# EAGLE design snowflake-hw-simple-v0.0.1 (EAGLE 9.6.2)
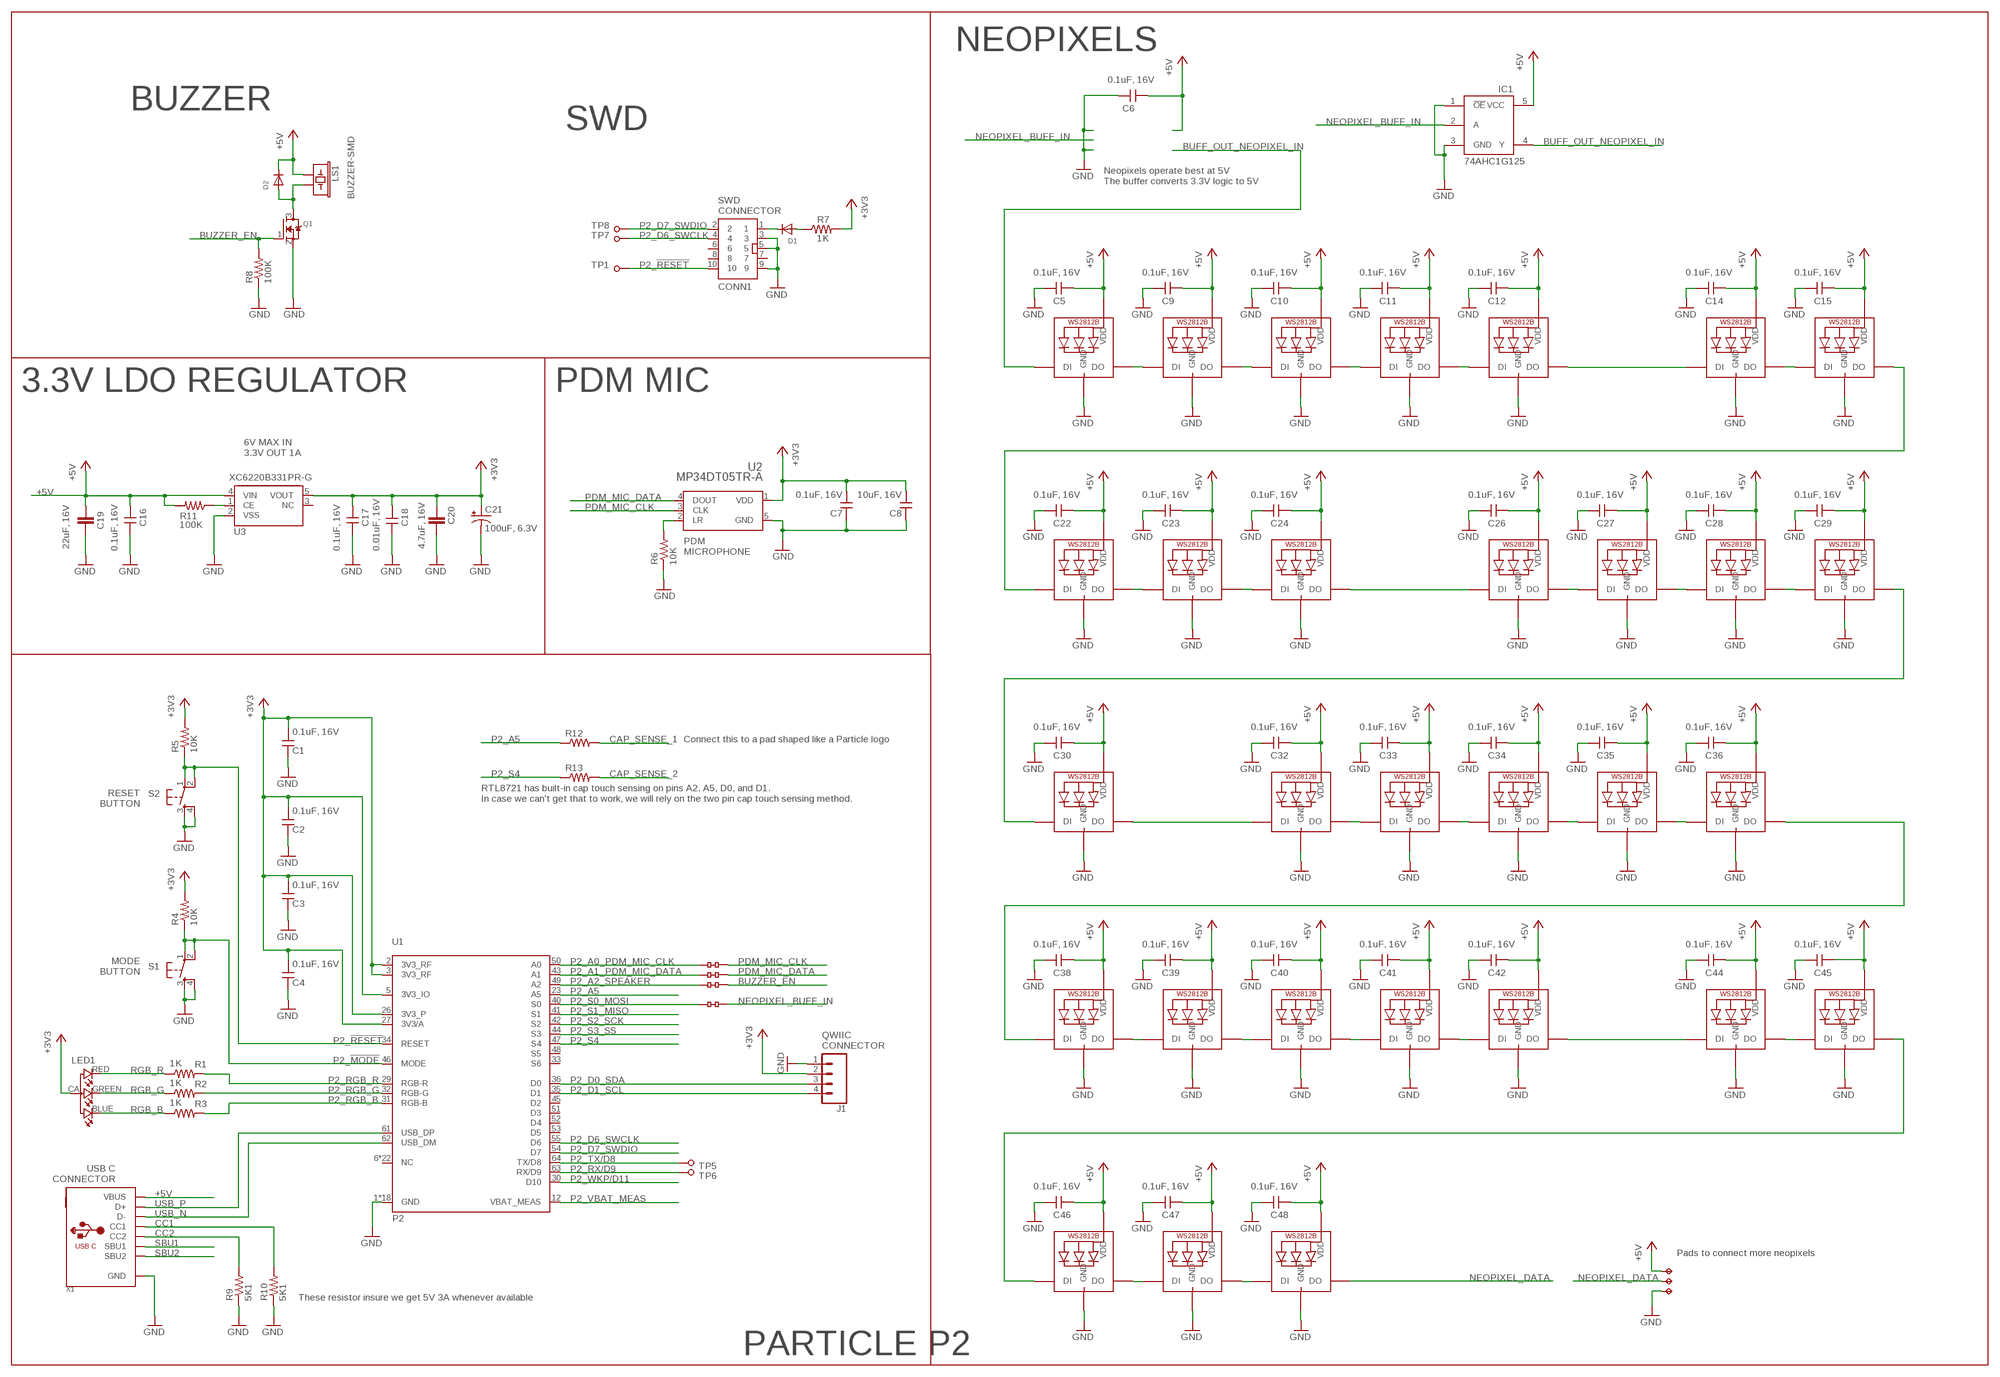
[diagram p0: schematic, sheet 1]

## Parts
C1  0.1uF, 16V  CAP_0.1UF_16V_0603  [C0603_P]
C2  0.1uF, 16V  CAP_0.1UF_16V_0603  [C0603_P]
C3  0.1uF, 16V  CAP_0.1UF_16V_0603  [C0603_P]
C4  0.1uF, 16V  CAP_0.1UF_16V_0603  [C0603_P]
C5  0.1uF, 16V  CAP_0.1UF_16V_0603  [C0603_P]
C6  0.1uF, 16V  CAP_0.1UF_16V_0603  [C0603_P]
C7  0.1uF, 16V  CAP_0.1UF_16V_0603  [C0603_P]
C8  10uF, 16V  CAP_10UF_16V_0603  [C0603_P]
C9  0.1uF, 16V  CAP_0.1UF_16V_0603  [C0603_P]
C10  0.1uF, 16V  CAP_0.1UF_16V_0603  [C0603_P]
C11  0.1uF, 16V  CAP_0.1UF_16V_0603  [C0603_P]
C12  0.1uF, 16V  CAP_0.1UF_16V_0603  [C0603_P]
C14  0.1uF, 16V  CAP_0.1UF_16V_0603  [C0603_P]
C15  0.1uF, 16V  CAP_0.1UF_16V_0603  [C0603_P]
C16  0.1uF, 16V  CAP_0.1UF_16V_0603  [C0603_P]
C17  0.1uF, 16V  CAP_0.1UF_16V_0603  [C0603_P]
C18  0.01uF, 16V  CAP_0.01UF_25V_0603  [C0603_P]
C19  22uF, 16V  C-EUC0805  [C0805]
C20  4.7uF, 16V  C-EUC0805  [C0805]
C21  100uF, 6.3V  CPOL-USC  [PANASONIC_C]
C22  0.1uF, 16V  CAP_0.1UF_16V_0603  [C0603_P]
C23  0.1uF, 16V  CAP_0.1UF_16V_0603  [C0603_P]
C24  0.1uF, 16V  CAP_0.1UF_16V_0603  [C0603_P]
C26  0.1uF, 16V  CAP_0.1UF_16V_0603  [C0603_P]
C27  0.1uF, 16V  CAP_0.1UF_16V_0603  [C0603_P]
C28  0.1uF, 16V  CAP_0.1UF_16V_0603  [C0603_P]
C29  0.1uF, 16V  CAP_0.1UF_16V_0603  [C0603_P]
C30  0.1uF, 16V  CAP_0.1UF_16V_0603  [C0603_P]
C32  0.1uF, 16V  CAP_0.1UF_16V_0603  [C0603_P]
C33  0.1uF, 16V  CAP_0.1UF_16V_0603  [C0603_P]
C34  0.1uF, 16V  CAP_0.1UF_16V_0603  [C0603_P]
C35  0.1uF, 16V  CAP_0.1UF_16V_0603  [C0603_P]
C36  0.1uF, 16V  CAP_0.1UF_16V_0603  [C0603_P]
C38  0.1uF, 16V  CAP_0.1UF_16V_0603  [C0603_P]
C39  0.1uF, 16V  CAP_0.1UF_16V_0603  [C0603_P]
C40  0.1uF, 16V  CAP_0.1UF_16V_0603  [C0603_P]
C41  0.1uF, 16V  CAP_0.1UF_16V_0603  [C0603_P]
C42  0.1uF, 16V  CAP_0.1UF_16V_0603  [C0603_P]
C44  0.1uF, 16V  CAP_0.1UF_16V_0603  [C0603_P]
C45  0.1uF, 16V  CAP_0.1UF_16V_0603  [C0603_P]
C46  0.1uF, 16V  CAP_0.1UF_16V_0603  [C0603_P]
C47  0.1uF, 16V  CAP_0.1UF_16V_0603  [C0603_P]
C48  0.1uF, 16V  CAP_0.1UF_16V_0603  [C0603_P]
CONN1  CONN5X2  [CONN5X2_1.27]
D1  DIODESOD-123  [SOD-123]
D2  DIODESOD-123  [SOD-123]
IC1  74AHC1G125  [SOT23-5L]
J1  CONN_04SMD4  [JST04_1MM_VERT]
LED1  RGB-LED-CLMVB-FKARGB  [PLCC4-2MM-RGB]
LED2  WS2812B_SK6812E  [NEO3535_REVERSE]
LED3  WS2812B_SK6812E  [NEO3535_REVERSE]
LED4  WS2812B_SK6812E  [NEO3535_REVERSE]
LED5  WS2812B_SK6812E  [NEO3535_REVERSE]
LED6  WS2812B_SK6812E  [NEO3535_REVERSE]
LED8  WS2812B_SK6812E  [NEO3535_REVERSE]
LED9  WS2812B_SK6812E  [NEO3535_REVERSE]
LED10  WS2812B_SK6812E  [NEO3535_REVERSE]
LED11  WS2812B_SK6812E  [NEO3535_REVERSE]
LED12  WS2812B_SK6812E  [NEO3535_REVERSE]
LED14  WS2812B_SK6812E  [NEO3535_REVERSE]
LED15  WS2812B_SK6812E  [NEO3535_REVERSE]
LED16  WS2812B_SK6812E  [NEO3535_REVERSE]
LED17  WS2812B_SK6812E  [NEO3535_REVERSE]
LED18  WS2812B_SK6812E  [NEO3535_REVERSE]
LED20  WS2812B_SK6812E  [NEO3535_REVERSE]
LED21  WS2812B_SK6812E  [NEO3535_REVERSE]
LED22  WS2812B_SK6812E  [NEO3535_REVERSE]
LED23  WS2812B_SK6812E  [NEO3535_REVERSE]
LED24  WS2812B_SK6812E  [NEO3535_REVERSE]
LED26  WS2812B_SK6812E  [NEO3535_REVERSE]
LED27  WS2812B_SK6812E  [NEO3535_REVERSE]
LED28  WS2812B_SK6812E  [NEO3535_REVERSE]
LED29  WS2812B_SK6812E  [NEO3535_REVERSE]
LED30  WS2812B_SK6812E  [NEO3535_REVERSE]
LED32  WS2812B_SK6812E  [NEO3535_REVERSE]
LED33  WS2812B_SK6812E  [NEO3535_REVERSE]
LED34  WS2812B_SK6812E  [NEO3535_REVERSE]
LED35  WS2812B_SK6812E  [NEO3535_REVERSE]
LED36  WS2812B_SK6812E  [NEO3535_REVERSE]
LS1  BUZZER-SMD  [BUZZER-CCV]
Q1  MOSFET-NREFLOW  [SOT23]
R1  1K  RES_1K_0603  [R0603_P]
R2  1K  RES_1K_0603  [R0603_P]
R3  1K  RES_1K_0603  [R0603_P]
R4  10K  RES_10K_0603  [R0603_P]
R5  10K  RES_10K_0603  [R0603_P]
R6  10K  RES_10K_0603  [R0603_P]
R7  1K  RES_1K_0603  [R0603_P]
R8  100K  RES_100K_0603  [R0603_P]
R9  5K1  RES_0603  [R0603_P]
R10  5K1  RES_0603  [R0603_P]
R11  100K  RES_100K_0603  [R0603_P]
R12  RES_0603  [R0603_P]
R13  RES_0603  [R0603_P]
S1  TAC_SWITCHSMD  [TACTILE_SWITCH_SMD]
S2  TAC_SWITCHSMD  [TACTILE_SWITCH_SMD]
TP1  TP-1.5MM  [TP]
TP2  TPTP20SQ  [TP20SQ]
TP3  TPTP20SQ  [TP20SQ]
TP4  TPTP20SQ  [TP20SQ]
TP5  TP-1.5MM  [TP]
TP6  TP-1.5MM  [TP]
TP7  TP-1.5MM  [TP]
TP8  TP-1.5MM  [TP]
U1  P2  [P2]
U2  MP34DT05TR-A  [MP34DT05TR-A_STM]
U3  XC6220B331PR-G  XC6220B331PR-GSOT-89-5_TOR-M  [SOT-89-5_TOR-M]
U$2  JMP_0603_NC  [JMP_0603_NC]
U$3  JMP_0603_NC  [JMP_0603_NC]
U$4  JMP_0603_NC  [JMP_0603_NC]
U$15  JMP_0603_NC  [JMP_0603_NC]
X1  USB_C  [USB_C_CUSB31-CFM2AX-01-X]

## Nets
+3V3: C1.1 C2.1 C3.1 C4.1 C7.1 C8.1 C17.2 C18.1 C20.1 C21.+ J1.2 LED1.CA R4.2 R5.2 R7.2 U1.2(3V3_RF) U1.3(3V3_RF) U1.5(3V3_IO) U1.26(3V3_P) U1.27(3V3/A) U2.1(VDD) U3.5(VOUT)
+5V: C5.2 C6.2 C9.2 C10.2 C11.2 C12.2 C14.2 C15.2 C16.2 C19.1 C22.2 C23.2 C24.2 C26.2 C27.2 C28.2 C29.2 C30.2 C32.2 C33.2 C34.2 C35.2 C36.2 C38.2 C39.2 C40.2 C41.2 C42.2 C44.2 C45.2 C46.2 C47.2 C48.2 D2.C IC1.5(VCC) LED2.1-VDD(VDD) LED3.1-VDD(VDD) LED4.1-VDD(VDD) LED5.1-VDD(VDD) LED6.1-VDD(VDD) LED8.1-VDD(VDD) LED9.1-VDD(VDD) LED10.1-VDD(VDD) LED11.1-VDD(VDD) LED12.1-VDD(VDD) LED14.1-VDD(VDD) LED15.1-VDD(VDD) LED16.1-VDD(VDD) LED17.1-VDD(VDD) LED18.1-VDD(VDD) LED20.1-VDD(VDD) LED21.1-VDD(VDD) LED22.1-VDD(VDD) LED23.1-VDD(VDD) LED24.1-VDD(VDD) LED26.1-VDD(VDD) LED27.1-VDD(VDD) LED28.1-VDD(VDD) LED29.1-VDD(VDD) LED30.1-VDD(VDD) LED32.1-VDD(VDD) LED33.1-VDD(VDD) LED34.1-VDD(VDD) LED35.1-VDD(VDD) LED36.1-VDD(VDD) LS1.+ R11.2 TP2.TP U3.4(VIN) X1.A4B9(VBUS) X1.B4A9(VBUS)
BUFF_OUT_NEOPIXEL_IN: IC1.4(Y) LED2.4-DIN(DI)
BUZZER_EN: Q1.1(G) R8.2 U$2.2
CAP_SENSE_1: R12.2
CAP_SENSE_2: R13.2
CC1: R10.2 X1.A5(CC1)
CC2: R9.2 X1.B5(CC2)
GND: C1.2 C2.2 C3.2 C4.2 C5.1 C6.1 C7.2 C8.2 C9.1 C10.1 C11.1 C12.1 C14.1 C15.1 C16.1 C17.1 C18.2 C19.2 C20.2 C21.- C22.1 C23.1 C24.1 C26.1 C27.1 C28.1 C29.1 C30.1 C32.1 C33.1 C34.1 C35.1 C36.1 C38.1 C39.1 C40.1 C41.1 C42.1 C44.1 C45.1 C46.1 C47.1 C48.1 CONN1.3 CONN1.5 CONN1.9 IC1.1(!OE) IC1.3(GND) J1.1 LED2.3-GND(GND) LED3.3-GND(GND) LED4.3-GND(GND) LED5.3-GND(GND) LED6.3-GND(GND) LED8.3-GND(GND) LED9.3-GND(GND) LED10.3-GND(GND) LED11.3-GND(GND) LED12.3-GND(GND) LED14.3-GND(GND) LED15.3-GND(GND) LED16.3-GND(GND) LED17.3-GND(GND) LED18.3-GND(GND) LED20.3-GND(GND) LED21.3-GND(GND) LED22.3-GND(GND) LED23.3-GND(GND) LED24.3-GND(GND) LED26.3-GND(GND) LED27.3-GND(GND) LED28.3-GND(GND) LED29.3-GND(GND) LED30.3-GND(GND) LED32.3-GND(GND) LED33.3-GND(GND) LED34.3-GND(GND) LED35.3-GND(GND) LED36.3-GND(GND) Q1.2(S) R6.1 R8.1 R9.1 R10.1 S1.3 S1.4 S2.3 S2.4 TP4.TP U1.1(GND) U1.4(GND) U1.13(GND) U1.15(GND) U1.25(GND) U1.28(GND) U1.37(GND) U1.39(GND) U1.59(GND) U1.65(GND) U1.66(GND) U1.67(GND) U1.68(GND) U1.69(GND) U1.70(GND) U1.71(GND) U1.72(GND) U1.73(GND) U2.5(GND) U3.2(VSS) X1.A1B12(GND) X1.B1A12(GND)
N$1: R6.2 U2.2(LR)
N$2: LED2.2-DOUT(DO) LED3.4-DIN(DI)
N$3: LED3.2-DOUT(DO) LED4.4-DIN(DI)
N$4: LED4.2-DOUT(DO) LED5.4-DIN(DI)
N$5: LED5.2-DOUT(DO) LED6.4-DIN(DI)
N$6: LED6.2-DOUT(DO) LED8.4-DIN(DI)
N$7: LED30.2-DOUT(DO) LED32.4-DIN(DI)
N$8: LED8.2-DOUT(DO) LED9.4-DIN(DI)
N$9: D2.A LS1.- Q1.3(D)
N$10: R11.1 U3.1(CE)
N$11: LED10.2-DOUT(DO) LED11.4-DIN(DI)
N$12: LED11.2-DOUT(DO) LED12.4-DIN(DI)
N$13: LED12.2-DOUT(DO) LED14.4-DIN(DI)
N$15: LED14.2-DOUT(DO) LED15.4-DIN(DI)
N$16: LED15.2-DOUT(DO) LED16.4-DIN(DI)
N$17: CONN1.1 D1.C
N$18: D1.A R7.1
N$19: LED16.2-DOUT(DO) LED17.4-DIN(DI)
N$20: LED9.2-DOUT(DO) LED10.4-DIN(DI)
N$21: LED24.2-DOUT(DO) LED26.4-DIN(DI)
N$22: LED23.2-DOUT(DO) LED24.4-DIN(DI)
N$23: LED22.2-DOUT(DO) LED23.4-DIN(DI)
N$24: LED21.2-DOUT(DO) LED22.4-DIN(DI)
N$25: LED20.2-DOUT(DO) LED21.4-DIN(DI)
N$27: LED18.2-DOUT(DO) LED20.4-DIN(DI)
N$29: LED26.2-DOUT(DO) LED27.4-DIN(DI)
N$30: LED27.2-DOUT(DO) LED28.4-DIN(DI)
N$31: LED28.2-DOUT(DO) LED29.4-DIN(DI)
N$32: LED29.2-DOUT(DO) LED30.4-DIN(DI)
N$35: LED32.2-DOUT(DO) LED33.4-DIN(DI)
N$36: LED17.2-DOUT(DO) LED18.4-DIN(DI)
N$37: LED34.2-DOUT(DO) LED35.4-DIN(DI)
N$38: LED35.2-DOUT(DO) LED36.4-DIN(DI)
N$40: LED33.2-DOUT(DO) LED34.4-DIN(DI)
NEOPIXEL_BUFF_IN: IC1.2(A) U$15.2
NEOPIXEL_DATA: LED36.2-DOUT(DO) TP3.TP
P2_!MODE: R4.1 S1.1 S1.2 U1.46(MODE)
P2_!RESET: CONN1.10 R5.1 S2.1 S2.2 TP1.TP U1.34(RESET)
P2_A0_PDM_MIC_CLK: U1.50(A0) U$4.1
P2_A1_PDM_MIC_DATA: U1.43(A1) U$3.1
P2_A2_SPEAKER: U1.49(A2) U$2.1
P2_A5: R12.1 U1.23(A5)
P2_D0_SDA: J1.3 U1.36(D0)
P2_D1_SCL: J1.4 U1.35(D1)
P2_D6_SWCLK: CONN1.4 TP7.TP U1.55(D6)
P2_D7_SWDIO: CONN1.2 TP8.TP U1.54(D7)
P2_RGB_B: R3.2 U1.31(RGB-B)
P2_RGB_G: R2.2 U1.32(RGB-G)
P2_RGB_R: R1.2 U1.29(RGB-R)
P2_RX/D9: TP6.TP U1.63(RX/D9)
P2_S0_MOSI: U1.40(S0) U$15.1
P2_S1_MISO: U1.41(S1)
P2_S2_SCK: U1.42(S2)
P2_S3_SS: U1.44(S3)
P2_S4: R13.1 U1.47(S4)
P2_TX/D8: TP5.TP U1.64(TX/D8)
P2_VBAT_MEAS: U1.12(VBAT_MEAS)
P2_WKP/D11: U1.30(D10)
PDM_MIC_CLK: U2.3(CLK) U$4.2
PDM_MIC_DATA: U2.4(DOUT) U$3.2
RGB_B: LED1.BLUE R3.1
RGB_G: LED1.GREEN R2.1
RGB_R: LED1.RED R1.1
SBU1: X1.A8(SBU1)
SBU2: X1.B8(SBU2)
USB_N: U1.62(USB_DM) X1.A7(D-) X1.B7(D-)
USB_P: U1.61(USB_DP) X1.A6(D+) X1.B6(D+)
Unconnected: CONN1.6 CONN1.7 CONN1.8 U1.6(NC) U1.7(NC) U1.8(NC) U1.9(NC) U1.10(NC) U1.11(NC) U1.14(NC) U1.16(NC) U1.17(NC) U1.18(NC) U1.19(NC) U1.20(NC) U1.21(NC) U1.22(NC) U1.24(NC) U1.33(S6) U1.38(NC) U1.45(D2) U1.48(S5) U1.51(D3) U1.52(D4) U1.53(D5) U1.56(NC) U1.57(NC) U1.58(NC) U1.60(NC) U1.74(NC) U1.75(NC) U3.3(NC)

## Notes on the sheet
- NEOPIXELS
- BUZZER
- SWD
- Neopixels operate best at 5V
  The buffer converts 3.3V logic to 5V
- SWD
  CONNECTOR
- 3.3V LDO REGULATOR | PDM MIC
- 6V MAX IN
  3.3V OUT 1A
- PDM
  MICROPHONE
- Connect this to a pad shaped like a Particle logo
- RTL8721 has built-in cap touch sensing on pins A2, A5, D0, and D1. 
  In case we can't get that to work, we will rely on the two pin cap touch sensing method.
- RESET
  BUTTON
- MODE
  BUTTON
- QWIIC
  CONNECTOR
- USB C
  CONNECTOR
- Pads to connect more neopixels
- These resistor insure we get 5V 3A whenever available
- PARTICLE P2

## Library data of the parts
C1-C7 C9-C12 C14-C17 C22-C24 C26-C30 C32-C36 C38-C42 C44-C48 = particle-studios:CAP_: Particle Capacitors; DESP: CAP CER 0.1UF 16V X7R 0603; MFG: FENGHUA; MPN: 0603B104K160NT; PPN: PT-200082
C8 = particle-studios:CAP_: Particle Capacitors; DESP: CAP CER 10UF 16V X7R 0603; MFG: FENGHUA; MPN: 0603X106M160NT; PPN: PT-200139
C18 = particle-studios:CAP_: Particle Capacitors; DESP: CAP CER 0.01UF 16V X7R 0603; MFG: YAGEO; MPN: CC0603KRX7R9BB103; PPN: PT-200456
C19 C20 = rcl:C-EU: CAPACITOR, European symbol; SPICEPREFIX: C
C21 = rcl:CPOL-US: POLARIZED CAPACITOR, American symbol; SPICEPREFIX: C
CONN1 = particle-studios:CONN5X2: 5x2 pin JTAG connector for Particle mesh dev kits
D1 D2 = particle-studios:DIODE: Diode SMADIODE - SMA Surface Mount Package 20V 1A Schottky Diode Digikey: 641-1014-6-ND DO-1N4148 - Through Hole Small Current Diode SOD-123 20V 1 A (.5mV Vf) Schottky Diode - Digikey: MBRX120TPMSCT-ND SOD-323 10V 570mA (.38mV Vf, 3ns) Schottky Diode - Digikey: ZLLS410CT-ND SOD-523 30V 30mA Schottky Diode (RB751S-40TE61) - Digikey: RB751S-40TE61CT-ND SOT23-R/W - SOT23 Package (R = Solder Paste/Reflow Ovens, W = Hand-Soldering) BAT54Film 40V 300mA - Digikey: 497-7162-1-ND
IC1 = adafruit:74AHC1G125
J1 = SparkFun-Connectors:CONN_04: Multi connection point. Often used as Generic Header-pin footprint for 0.1 inch spaced/style header connections On any of the 0.1 inch spaced packages, you can populate with these: Break Away Headers - Straight (PRT-00116) Break Away Male Headers - Right Angle (PRT-00553) Female Headers (PRT-00115) Break Away Headers - Machine Pin (PRT-00117) Break Away Female Headers - Swiss Machine Pin (PRT-00743) For SCREWTERMINALS and SPRING TERMINALS visit here: Screw Terimnals on SparkFun.com (5mm/3.5mm/2.54mm spacing) This device is also useful as a general connection point to wire up your design to another part of your project. Our various solder wires solder well into these plated through hole pads. Hook-Up Wire - Assortment (Stranded, 22 AWG) (PRT-11375) Hook-Up Wire - Assortment (Solid Core, 22 AWG) (PRT-11367) View the entire wire category on our website here Special notes: Molex polarized connector foot print use with SKU : PRT-08231 with associated crimp pins and housings. 1MM SMD Version SKU: PRT-10208; COLOR: BLACK; PROD_ID: CONN-14483
LED1 = particle-studios:RGB-LED-CLMVB-FKA: CREE CLMVB-FKA RGB LED 2mm x 2mm
LED2-LED6 LED8-LED12 LED14-LED18 LED20-LED24 LED26-LED30 LED32-LED36 = microbuilder:WS2812B
LS1 = SparkFun-Electromechanical:BUZZER: Buzzer Small round buzzers that operate around the audible 2kHz range. You can use these as speakers to create simple music or user interfaces. Variant Overview: PTH - Mini Speaker - PC Mount 12mm 2.048kHz PTH_KIT - Mini Speaker - PC Mount 12mm 2.048kHz KIT simplifies soldering by adding stop mask to one side of the pads. PTH_NO_SILK - Mini Speaker - PC Mount 12mm 2.048kHz No silkscreen indicator of buzzer outline. PTH_KIT_NO_SILK - Mini Speaker - PC Mount 12mm 2.048kHz KIT package w/o silkscreen SMD - Buzzer Audio Magnetic (CCV-084B16) SMD buzzer used on, e.g. the LilyPad Buzzer and RFID USB Reader. SMD_KIT - Buzzer Audio Magnetic (CCV-084B16) SMD Buzzer with elongated pins to make soldering easier. Used on the SparkFun Simon Says - Surface Mount Soldering Kit.; PROD_ID: COMP-08568
Q1 = adafruit:MOSFET-N: N-Channel Mosfet 2N7002E - 60V 260mA SOT23 [Digikey: 2N7002ET1GOSTR-ND] - REEL BSH103 - 30V 850mA SOT23 [Digikey: 568-5013-1-ND]
R1-R3 R7 = particle-studios:RES_: Particle Resistors; DESP: RES SMD 1K OHM 1% 1/10W 0603; MFG: FENGHUA; MPN: RC-03K102FT; PPN: PT-200135
R4-R6 = particle-studios:RES_: Particle Resistors; DESP: RES SMD 10K OHM 1% 1/10W 0603; MFG: YAGEO; MPN: RC0603FR-0710KL; PPN: PT-200477
R8 R11 = particle-studios:RES_: Particle Resistors; DESP: RES SMD 100K OHM 1% 1/10W 0603
R9 R10 R12 R13 = particle-studios:RES_: Particle Resistors
S1 S2 = particle-studios:TAC_SWITCH: SMD Tactiile Switch
TP1 TP5-TP8 = particle-studios:TP-1.5MM
TP2-TP4 = testpad:TP: Test pad
U1 = particle-studios:P2: Particle P2
U2 = particle-studios:MP34DT05TR-A; COPYRIGHT: Copyright (C) 2023 Ultra Librarian. All rights reserved.; DIGIKEY_PART_NUMBER_1: MP34DT05TR-A-ND; DIGIKEY_PART_NUMBER_2: 497-17809-1-ND; DIGIKEY_PART_NUMBER_3: 497-17809-2-ND; DIGIKEY_PART_NUMBER_4: 497-17809-6-ND; MANUFACTURER_PART_NUMBER: MP34DT05TR-A; MFR_NAME: STMicroelectronics
U3 = particle-studios:XC6220B331PR-G; COPYRIGHT: Copyright (C) 2022 Ultra Librarian. All rights reserved.; DIGI-KEY_PART_NUMBER_1: 893-1128-1-ND; DIGI-KEY_PART_NUMBER_2: 893-1128-2-ND; DIGI-KEY_PART_NUMBER_3: 893-1128-2-NDL; DIGI-KEY_PART_NUMBER_4: 893-1128-6-ND; MANUFACTURER_PART_NUMBER: XC6220B331PR-G; MFR_NAME: Torex Semiconductor
U$2-U$4 U$15 = particle-studios:JMP_0603_NC
X1 = microbuilder:USB_C: USB Type-C USB 2.0 Connector

## Board
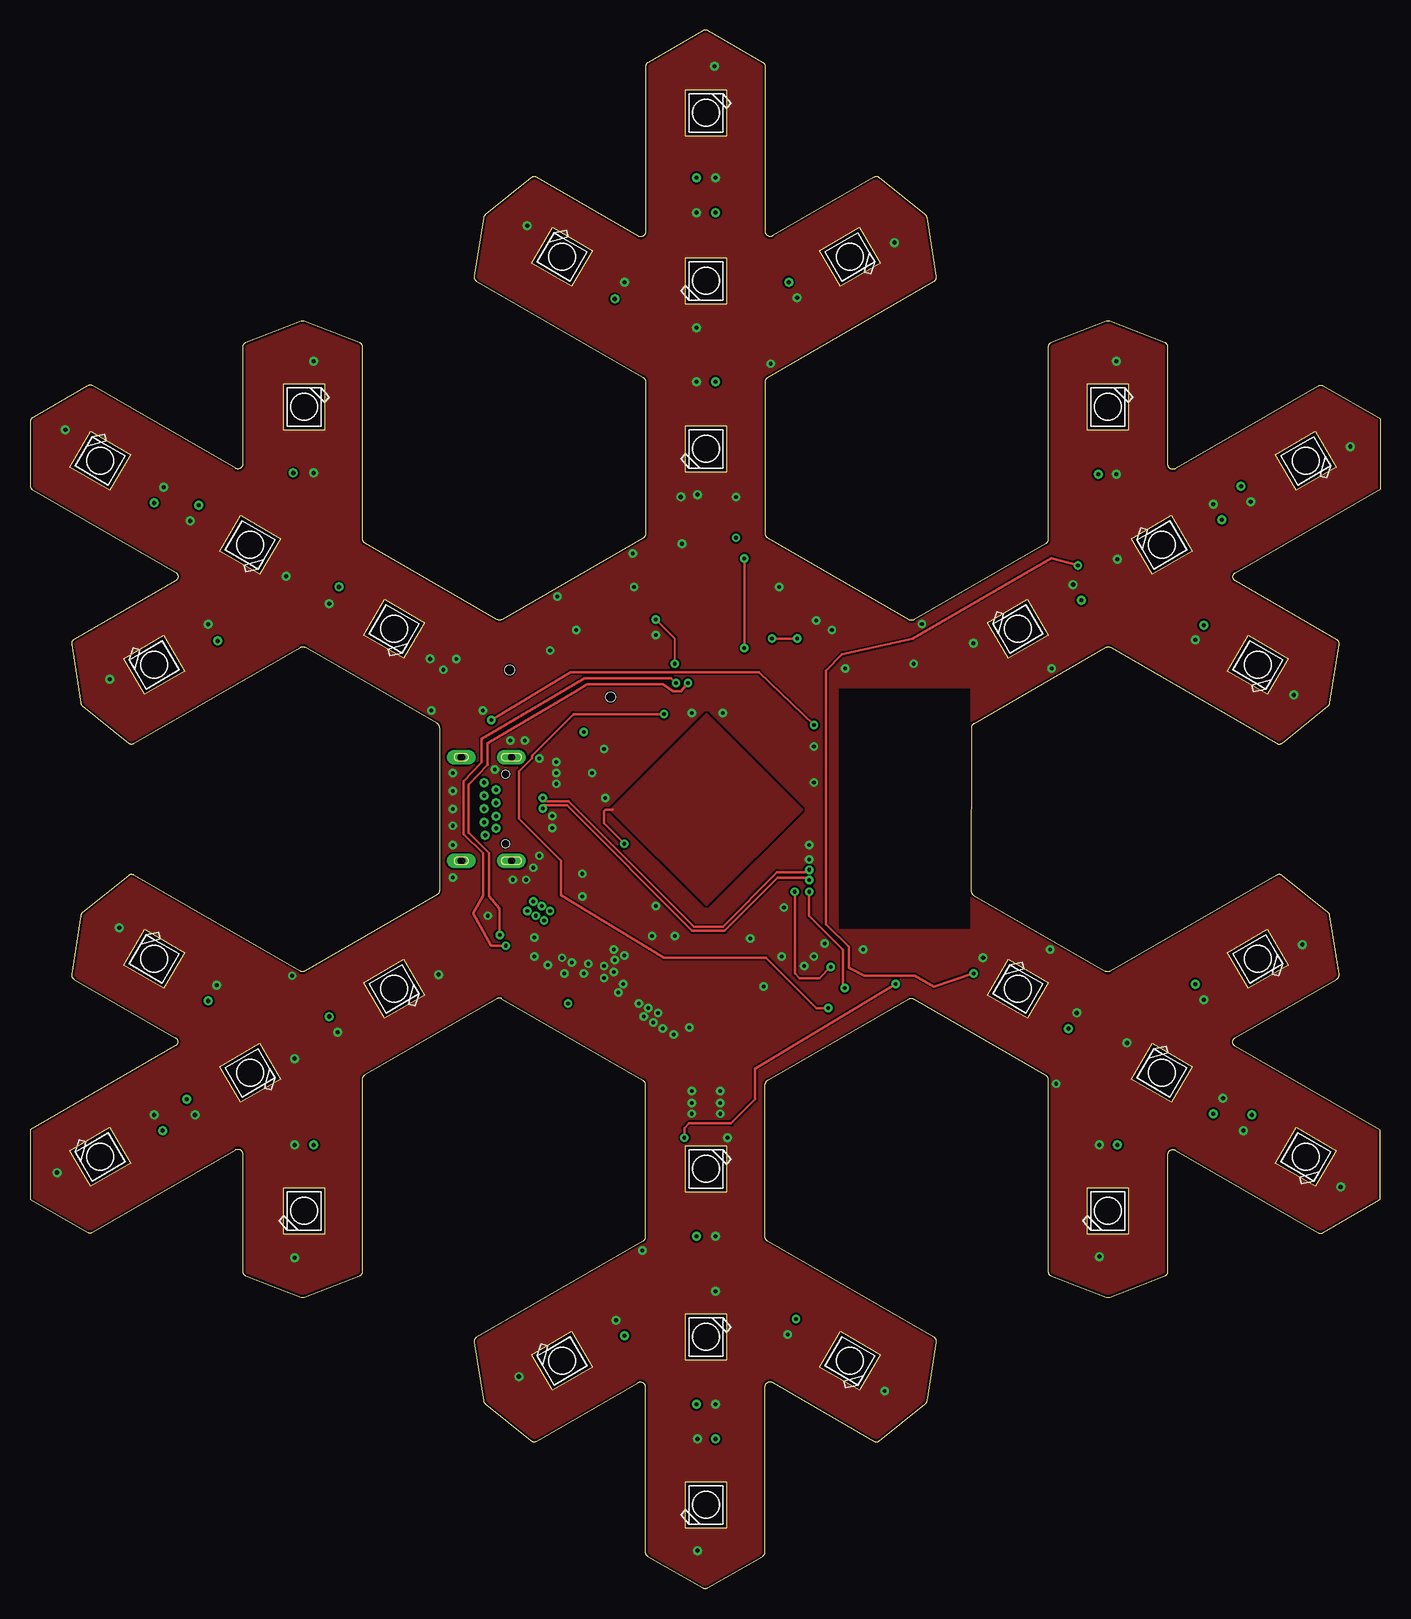
[diagram p1: board, top side]
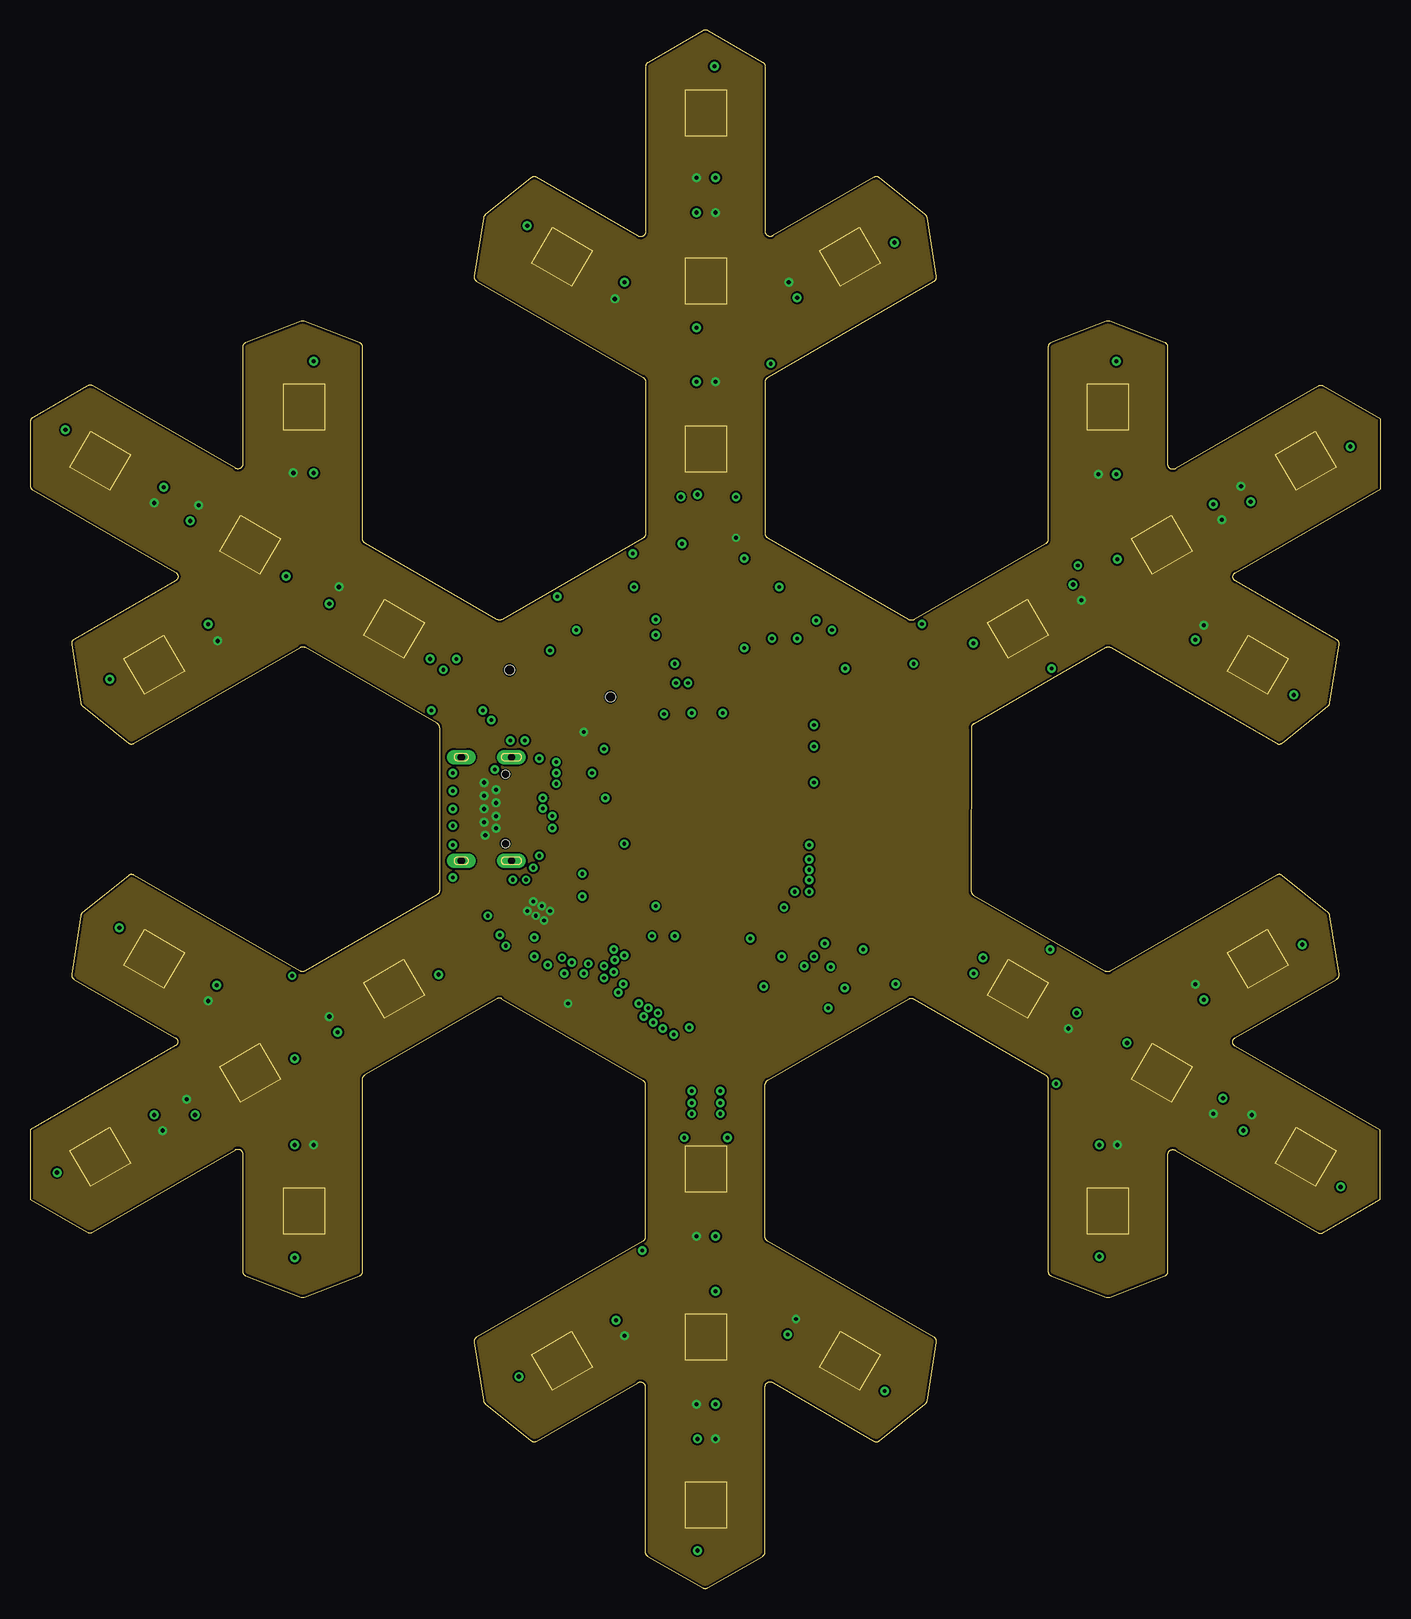
[diagram p2: board, inner layer Route2]
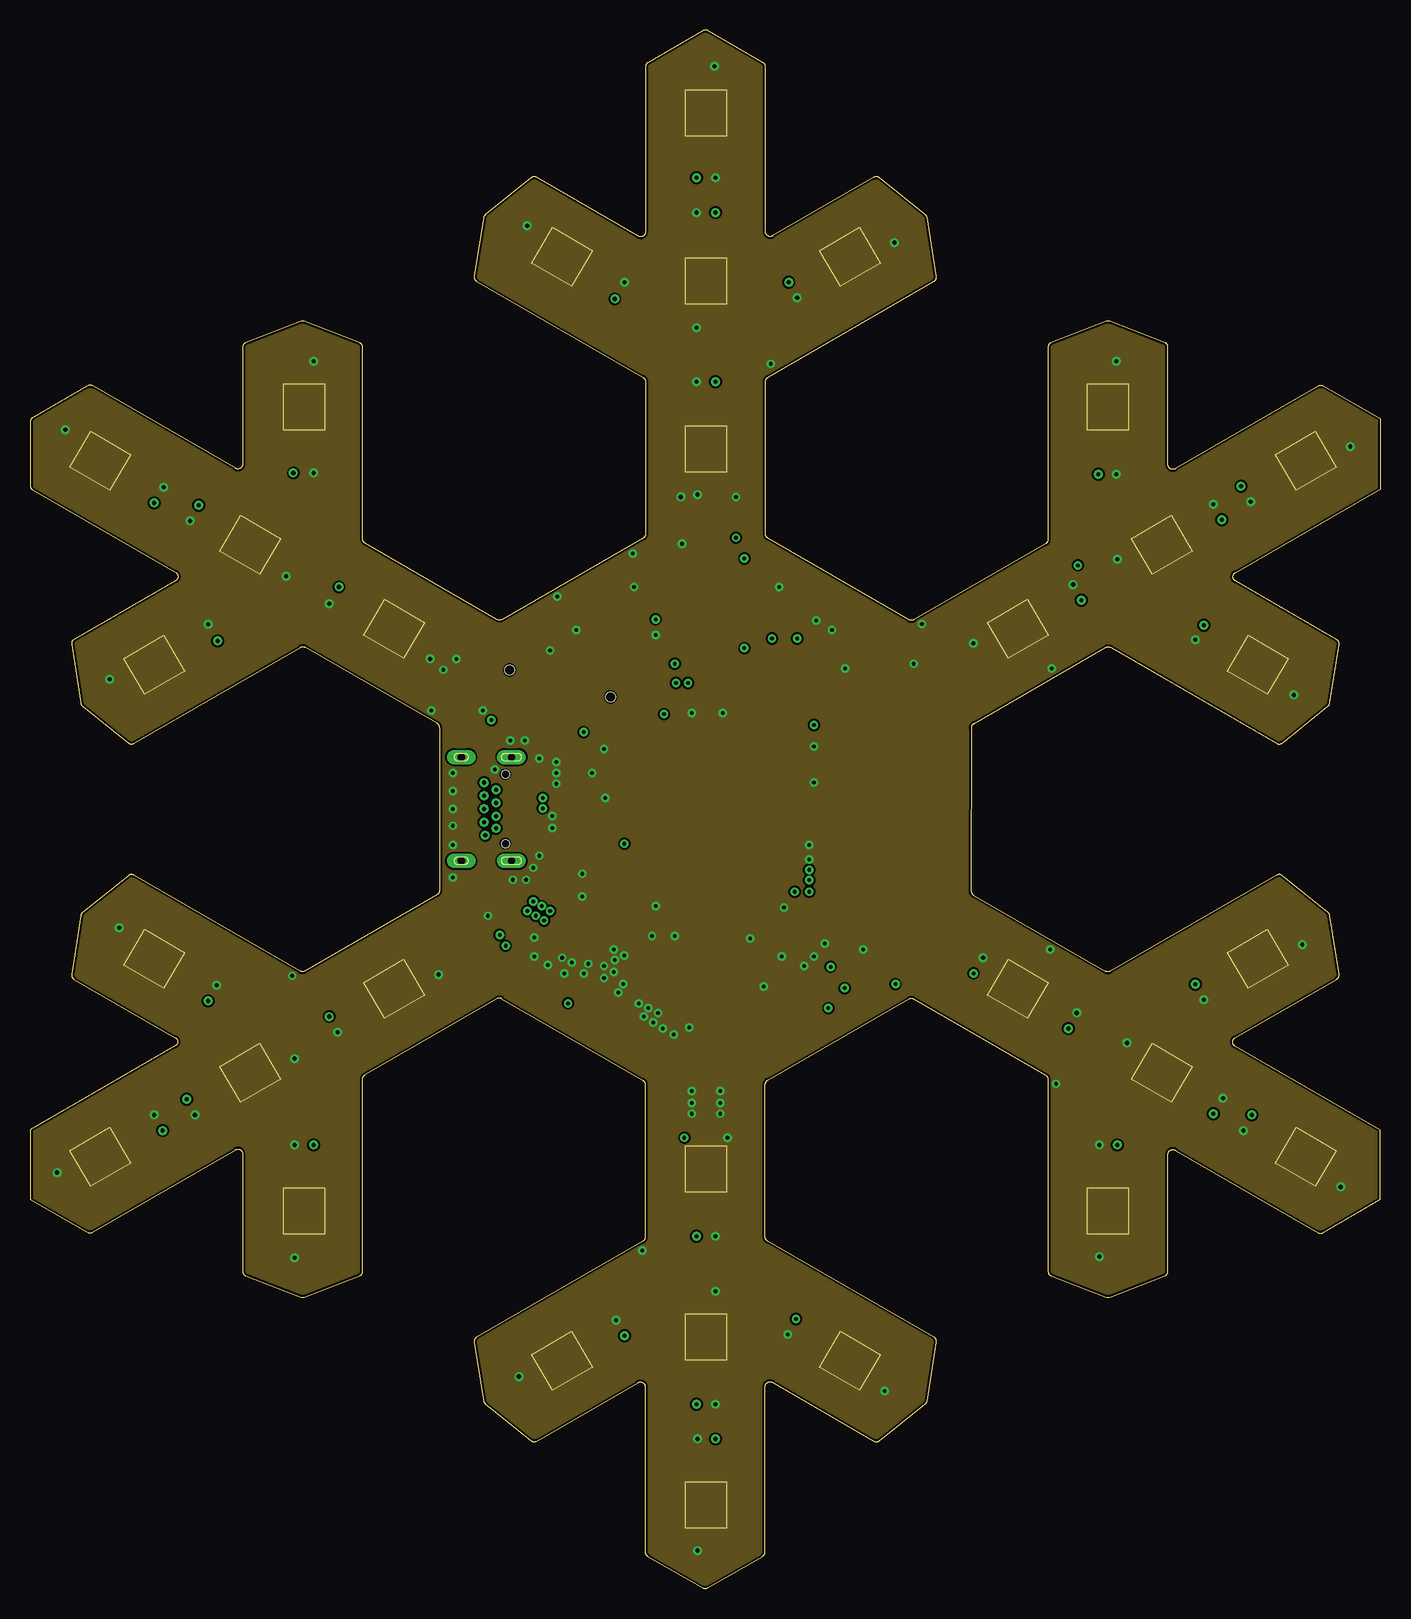
[diagram p3: board, inner layer Route15]
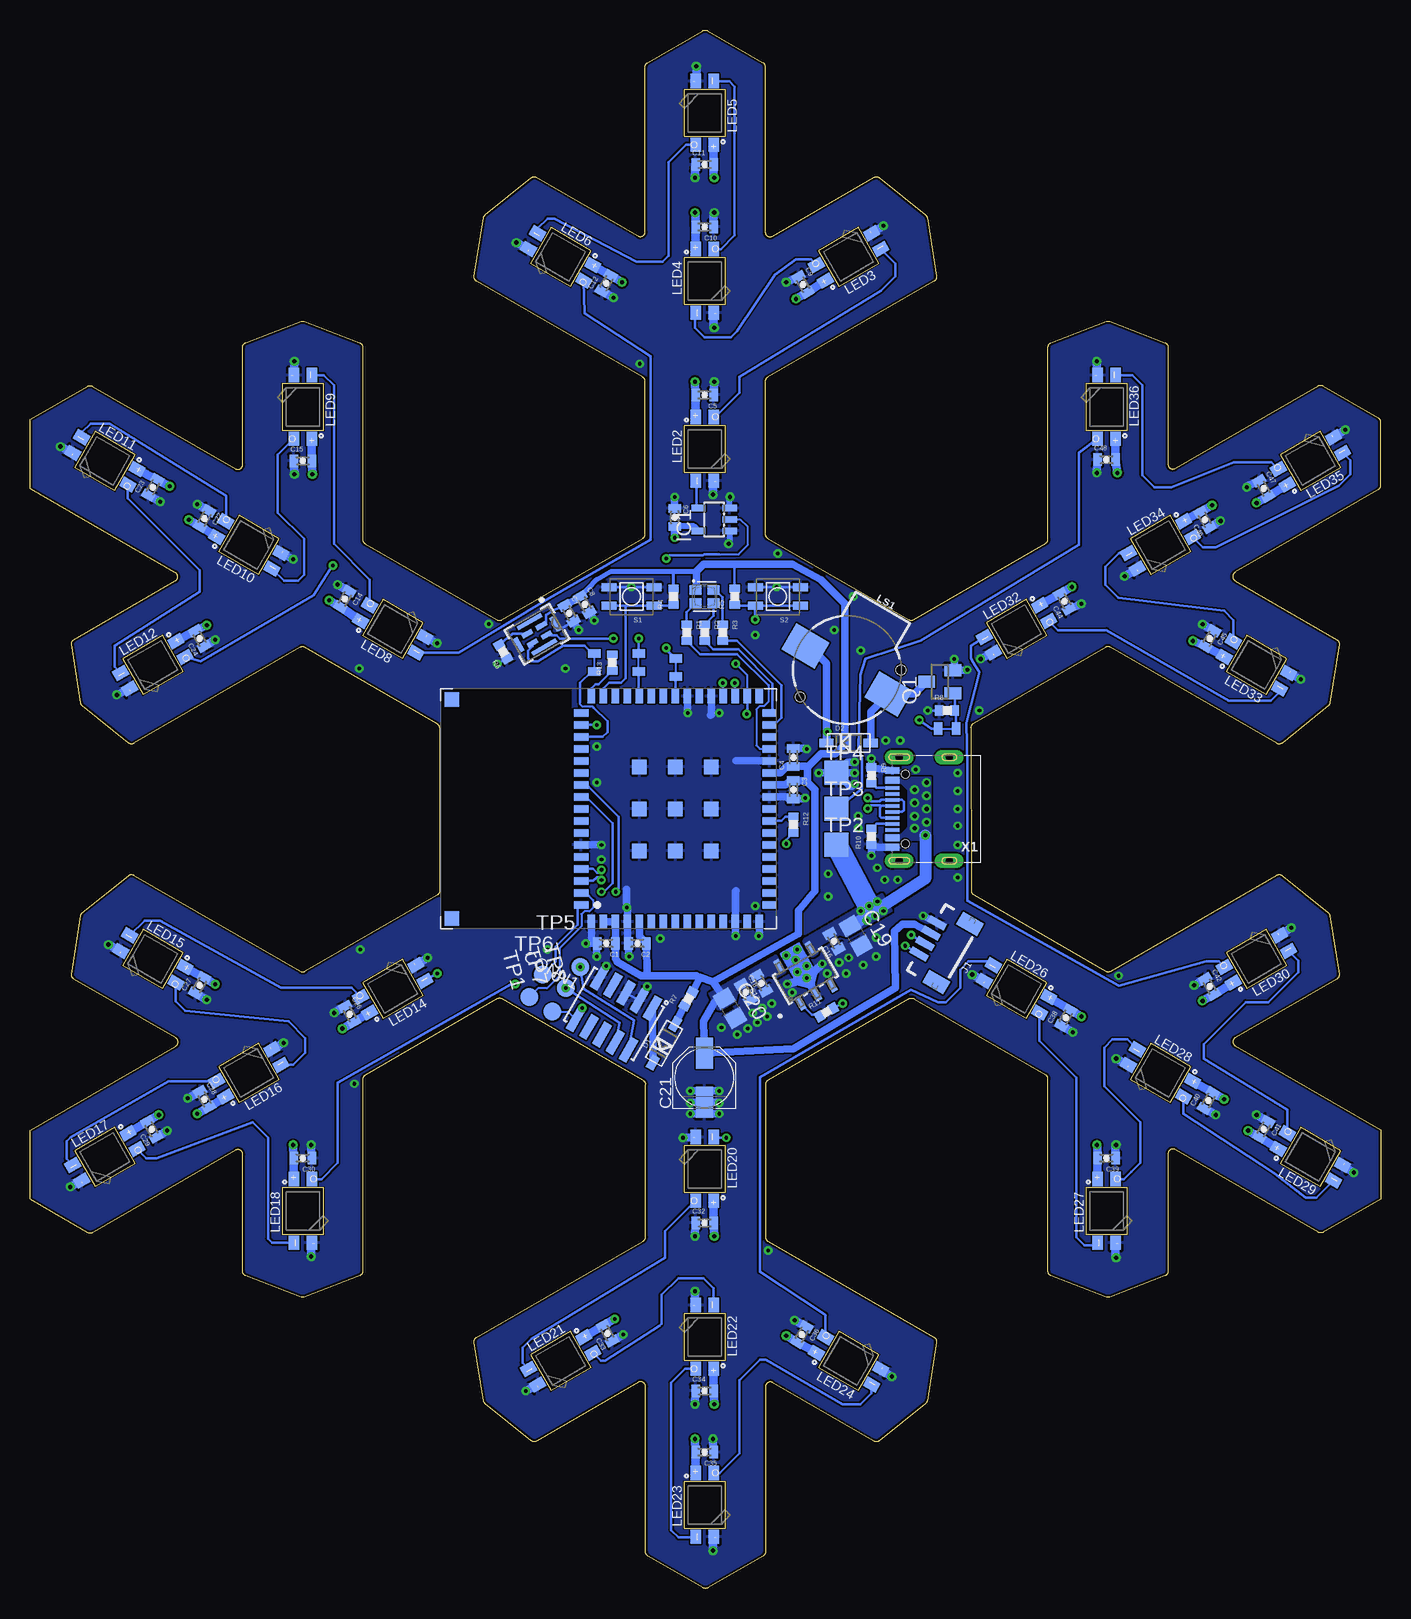
[diagram p4: board, bottom side, seen from below]

Size 112.6 x 129.88 mm. Coordinates in mm from the lower left corner, seen from the top.
Outline: 174 segments
Copper layers (1+2*15+16): Top 0.018mm / dielectric 0.195mm / Route2 0.035mm / dielectric 1.1mm / Route15 0.035mm / dielectric 0.195mm / Bottom 0.018mm
Design rules "particle-4layer *": minimum track width 6mil, minimum drill 0.3mm, track to track 6mil, track to pad 6mil, pad to pad 6mil, via to via 6mil, smd to smd 0mil, copper to edge 6mil, drill to drill 6mil, minimum pad ring 12mil, minimum via ring 8mil, stop-mask expansion 0mil, vias tented up to drill 20mil, thermal gap 8mil

### Footprints (pad centres in the part's own frame; a part is rotated, then mirrored left to right if it is on the bottom)
C0603_P = smd 0.711 x 1.041: 1 -0.749,0; 2 0.749,0
C0805 = smd 1.3 x 1.5: 1 -0.95,0; 2 0.95,0
PANASONIC_C = smd 2.6 x 1.4: + 2.05,0; - -2.05,0
CONN5X2_1.27 = smd 0.7 x 2.1: 1 -2.54,-2; 2 -2.54,2; 3 -1.27,-2; 4 -1.27,2; 5 0,-2; 6 0,2; 7 1.27,-2; 8 1.27,2; 9 2.54,-2; 10 2.54,2
SOD-123 = smd 1.2 x 0.7: A 1.85,0; C -1.85,0
SOT23-5L = smd 0.55 x 1.2: 1 -0.95,-1.3; 2 0,-1.3; 3 0.95,-1.3; 4 0.95,1.3; 5 -0.95,1.3
JST04_1MM_VERT = smd 0.6 x 1.55: 1 -1.5,0.775; 2 -0.5,0.775; 3 0.5,0.775; 4 1.5,0.775 | smd 1.2 x 2: NC1 -2.8,3.2; NC2 2.8,3.2
PLCC4-2MM-RGB = smd 1 x 0.8: BLUE -0.75,-0.55; CA 0.75,-0.55; GREEN -0.75,0.55; RED 0.75,0.55
NEO3535_REVERSE = smd 1.2 x 0.9 bottom: 1-VDD 2.65,-0.75; 2-DOUT 2.65,0.75; 3-GND -2.65,0.75; 4-DIN -2.65,-0.75
BUZZER-CCV = smd 3.2 x 2.5: + 4,0; - -4,0 | hole 0.8: -3.9,-2.25; 2.25,3.9
SOT23 = smd 1 x 1.4: 1 -0.95,-1.1; 2 0.95,-1.1; 3 0,1.1
R0603_P = smd 0.7 x 0.85: 1 -0.65,0; 2 0.65,0
TACTILE_SWITCH_SMD = smd 1.25 x 0.65: 1 -1.875,0.775; 2 1.875,0.775; 3 -1.875,-0.775; 4 1.875,-0.775
TP = smd 1.5 x 1.5: TP 0,0
TP20SQ = smd 2 x 2: TP 0,0
P2 = smd 1.2 x 0.6: 1 -9.4,2.45; 2 -9.4,1.45; 3 -9.4,0.45; 4 -9.4,-0.55; 5 -9.4,-1.55; 6 -9.4,-2.55; 7 -9.4,-3.55; 8 -9.4,-4.55; 9 -9.4,-5.55; 10 -9.4,-6.55; 11 -9.4,-7.55; 12 -9.4,-8.55; 13 -9.4,-9.55; 14 -9.4,-10.55; 15 -9.4,-11.55; 33 9.4,-11.55; 34 9.4,-10.55; 35 9.4,-9.55; 36 9.4,-8.55; 37 9.4,-7.55; 38 9.4,-6.55; 39 9.4,-5.55; 40 9.4,-4.55; 41 9.4,-3.55; 42 9.4,-2.55; 43 9.4,-1.55; 44 9.4,-0.55; 45 9.4,0.45; 46 9.4,1.45; 47 9.4,2.45 | smd 0.6 x 1.2: 16 -8,-12.4; 17 -7,-12.4; 18 -6,-12.4; 19 -5,-12.4; 20 -4,-12.4; 21 -3,-12.4; 22 -2,-12.4; 23 -1,-12.4; 24 0,-12.4; 25 1,-12.4; 26 2,-12.4; 27 3,-12.4; 28 4,-12.4; 29 5,-12.4; 30 6,-12.4; 31 7,-12.4; 32 8,-12.4; 48 8,3.3; 49 7,3.3; 50 6,3.3; 51 5,3.3; 52 4,3.3; 53 3,3.3; 54 2,3.3; 55 1,3.3; 56 0,3.3; 57 -1,3.3; 58 -2,3.3; 59 -3,3.3; 60 -4,3.3; 61 -5,3.3; 62 -6,3.3; 63 -7,3.3; 64 -8,3.3 | smd 1.2 x 1.2: 65 -3.5,-1.55; 66 -3.5,-4.55; 67 -3.5,-7.55; 68 0,-1.55; 69 0,-4.55; 70 0,-7.55; 71 3.5,-1.55; 72 3.5,-4.55; 73 3.5,-7.55; 74 9.12,14.07; 75 -9.12,14.07
MP34DT05TR-A_STM = smd 0.406 x 0.94: 1 -0.45,0.675; 2 -0.45,-0.675; 3 0.45,-0.675; 4 0.45,0.675 | smd 1.295 x 0.356: 5 0,1.725; 6 0,-1.725 | smd 0.356 x 2.311: 7 -1.225,0; 8 1.225,0
SOT-89-5_TOR-M = smd 0.483 x 1.118: 1 -1.5,-1.803; 3 1.5,-1.803; 4 1.5,1.803; 5 -1.5,1.803 | smd 0.533 x 1.118: 2 0,-1.803
JMP_0603_NC = smd 0.711 x 1.041: 1 -0.749,0; 2 0.749,0
USB_C_CUSB31-CFM2AX-01-X = smd 0.575 x 1.15: A1B12 -3.2,7.355; A4B9 -2.4,7.355; B1A12 3.2,7.355; B4A9 2.4,7.355 | smd 0.275 x 1.15: A5 -1.25,7.355; A6 -0.25,7.355; A7 0.25,7.355; A8 1.25,7.355; B5 1.75,7.355; B6 0.75,7.355; B7 -0.75,7.355; B8 -1.75,7.355 | drill 0.6 pad 1 long: M1 -4.32,6.78; M2 4.32,6.78; M3 -4.32,2.6; M4 4.32,2.6 | hole 0.65: 2.89,6.28; -2.89,6.28

### Placement (x,y rotation side)
C1  64.55,53.76 180 bottom
C2  61.95,53.76 180 bottom
C3  48.95,66.56 270 bottom
C4  48.95,69.26 90 bottom
C5  56.35,99.46 180 bottom
C6  58.85,89.26 270 bottom
C7  67.65,81.26 300 bottom
C8  66.35,82.01 300 bottom
C9  48.15,108.66 300 bottom
C10  56.35,113.46 180 bottom
C11  56.35,118.66 0 bottom
C12  64.55,108.76 60 bottom
C14  86.35,82.46 240 bottom
C15  89.85,93.96 0 bottom
C16  45.57,53.94 120 bottom
C17  51.63,50.44 120 bottom
C18  52.93,49.69 300 bottom
C19  43.76,54.41 300 bottom
C20  54.24,48.36 300 bottom
C21  56.38,42.56 90 bottom
C22  98.05,89.16 240 bottom
C23  102.35,91.76 60 bottom
C24  98.45,79.16 120 bottom
C26  85.95,47.86 300 bottom
C27  98.45,50.26 60 bottom
C28  98.05,40.76 300 bottom
C29  102.45,38.26 120 bottom
C30  89.85,35.86 180 bottom
C32  56.35,30.46 0 bottom
C33  64.45,21.26 120 bottom
C34  56.35,16.46 0 bottom
C35  56.35,11.36 180 bottom
C36  48.25,21.16 240 bottom
C38  26.25,47.56 60 bottom
C39  22.85,35.86 180 bottom
C40  14.35,40.66 60 bottom
C41  9.75,38.26 240 bottom
C42  14.25,50.16 300 bottom
C44  26.35,82.26 120 bottom
C45  14.25,79.16 240 bottom
C46  14.65,89.06 120 bottom
C47  9.75,91.66 300 bottom
C48  22.85,94.06 0 bottom
CONN1  63.9,47.9 150 bottom
D1  59.74,45.44 60 bottom
D2  44.35,70.46 0 bottom
IC1  55.57,89.08 90 bottom
J1  38.41,54.56 240 bottom
LED1  56.35,82.66 180 bottom
LED2  56.35,94.96 90 top
LED3  44.35,110.96 330 top
LED4  56.35,108.96 90 top
LED5  56.35,122.96 270 top
LED6  68.35,110.96 210 top
LED8  82.35,79.96 30 top
LED9  89.85,98.46 270 top
LED10  94.35,86.96 30 top
LED11  106.35,93.96 210 top
LED12  102.35,76.96 150 top
LED14  82.35,49.96 330 top
LED15  102.35,52.46 210 top
LED16  94.35,42.96 330 top
LED17  106.35,35.96 150 top
LED18  89.85,31.46 90 top
LED20  56.35,34.96 270 top
LED21  68.35,18.96 150 top
LED22  56.35,20.96 270 top
LED23  56.35,6.96 90 top
LED24  44.35,18.96 30 top
LED26  30.35,49.96 210 top
LED27  22.85,31.46 90 top
LED28  18.35,42.96 210 top
LED29  5.85,35.96 30 top
LED30  10.35,52.46 330 top
LED32  30.35,79.96 150 top
LED33  10.35,76.96 30 top
LED34  18.35,86.96 150 top
LED35  5.85,93.96 330 top
LED36  22.85,98.46 270 top
LS1  44.49,76.55 150 bottom
Q1  36.75,75.56 90 bottom
R1  57.85,79.66 270 bottom
R2  56.35,79.66 270 bottom
R3  54.85,79.66 270 bottom
R4  58.95,82.66 90 bottom
R5  53.85,82.66 90 bottom
R6  73.15,78.06 120 bottom
R7  57.7,49.14 60 bottom
R8  36.15,73.16 0 bottom
R9  42.45,67.76 270 bottom
R10  42.45,62.66 90 bottom
R11  46.2,48.03 30 bottom
R12  48.95,63.66 270 bottom
R13  64.05,77.16 90 bottom
S1  62.45,82.66 180 bottom
S2  50.25,82.66 180 bottom
TP1  69.05,48.07 105 bottom
TP2  45.35,61.96 0 bottom
TP3  45.35,64.96 0 bottom
TP4  45.35,67.96 0 bottom
TP5  69.85,51.16 0 bottom
TP6  70.95,49.31 0 bottom
TP7  67.92,50.03 105 bottom
TP8  66.74,51.8 105 bottom
U1  63.35,64.96 90 bottom
U2  70.34,79.51 300 bottom
U3  47.95,51.06 30 bottom
U$2  36.15,71.66 0 bottom
U$3  61.85,77.16 90 bottom
U$4  65.55,77.16 90 bottom
U$15  58.75,76.76 90 bottom
X1  33.35,64.96 90 bottom

### Tracks (layer width: path | path; a pad name or v marks a point on that pad's centre or on a via)
+3V3
  Bottom 0.203: R5.2 53.85,85.16 53.65,85.36 | U2.1 69.83,80.4 69.68,80.4 69.6,80.48 69.6,81.01 69.59,81.02 69.59,81.13 69.55,81.16 68.85,81.56 C7.1
  Bottom 0.254: R4.2 58.95,84.66 59.05,84.76
  Bottom 0.406: C8.1 65.35,84.06 64.15,84.76 59.05,84.76 57.05,84.76
  Bottom 0.61: U1.2 U1.3 C1.1 63.8,52.46 63.64,52.3 63.64,52.24 61.65,51.06 61.15,51.06 | U1.5 61.8,54.36 C2.1 61.15,51.06 | U1.26 49.6,66.96 49.25,67.31 C3.1 47.9,67.31 | U1.27 50.05,67.96 49.5,68.51 C4.1 47.8,68.51 | 61.15,51.06 57.05,51.06 56.72,50.95 | 56.72,50.95 55.65,50.56 | 55.65,50.56 C20.1 55.55,48.86 56.45,47.26 C21.+ 48.97,44.97 40.45,50.06 40.55,54.76 39.85,55.36 38.85,55.36 J1.2 | R7.2 56.72,50.95 | C7.1 C8.1 | LED1.CA 57.05,83.26 57.05,84.76 56.45,85.36 53.65,85.36 49.05,85.36 46.65,84.06 44.65,82.06 44.65,70.36 45.45,69.56 46.65,69.56 47.7,68.51 47.8,68.51 | 47.8,68.51 47.8,67.41 47.9,67.31 | 47.9,67.31 47.15,66.56 47.15,58.16 48.55,56.46 48.54,54.54 55.65,50.56
  pour Bottom (isolate 0.1, no thermals): 49.67,51.35 50.37,50.94 51.04,51.12 51.08,51.11 51.11,51.09 51.11,51.09 53.62,49.64 53.65,49.61 53.66,49.57 53.66,49.57 53.82,48.95 55.05,48.24 55.24,48.29 55.97,49.55 50.47,52.73 50.41,52.71 49.65,51.4
+5V  (via drill 0.3, 0.35)
  Bottom 0.2: R11.2 v44.85,48.76
  Bottom 0.203: 58.6,88.76 C6.2
  Bottom 0.508: IC1.5 57.25,88.51 C6.2
  Bottom 0.61: C6.2 v58.85,87.56 | LS1.+ 47.57,78.16 47.25,78.16 46.2,77.11 D2.C 46.15,70.46 v46.15,71.36
  Bottom 0.7: LED5.1-VDD C11.2 55.6,117.61 v55.55,117.56 | LED4.1-VDD C10.2 57.1,114.61 v57.15,114.66 | LED3.1-VDD C9.2 v48.75,107.46 | LED2.1-VDD C5.2 v57.15,100.56 | LED32.1-VDD C44.2 v25.75,83.46 | LED36.1-VDD C48.2 v21.95,92.96 | LED35.1-VDD C47.2 v10.35,90.46 | LED34.1-VDD C46.2 v14.05,90.26 | LED33.1-VDD C45.2 v15.65,78.96 | LED30.1-VDD C42.2 v14.85,48.96 | LED29.1-VDD C41.2 v11.05,38.16 | LED28.1-VDD C40.2 v13.05,40.76 | LED26.1-VDD C38.2 v24.95,47.66 | LED20.1-VDD C32.2 v55.55,29.36 | LED24.1-VDD C36.2 v49.55,21.06 | LED23.1-VDD C35.2 v57.15,12.46 | v55.55,15.36 C34.2 LED22.1-VDD | LED18.1-VDD C30.2 v90.65,36.96 | LED17.1-VDD C29.2 v101.85,39.46 | LED16.1-VDD C28.2 v98.65,39.56 | LED15.1-VDD C27.2 v97.15,50.36 | LED14.1-VDD C26.2 v86.55,46.66 | LED8.1-VDD C14.2 v87.65,82.36 | LED12.1-VDD C24.2 v97.85,80.26 | LED10.1-VDD C22.2 v99.35,89.06 | LED11.1-VDD C23.2 v100.95,91.86 | LED9.1-VDD C15.2 v89.05,92.86 | LED6.1-VDD C12.2 v63.25,108.86 | LED27.1-VDD C39.2 23.6,36.91 v23.65,36.96 | LED21.1-VDD C33.2 v63.85,22.46
  Bottom 1.016: v37.95,62.76 37.95,59.16 43.65,55.46
  Bottom 1.8: v42.65,56.86 TP2.TP
  other vias: 37.85,67.16 37.85,64.96 37.85,66.06 37.85,63.86 38.85,66.56 38.85,65.46 38.85,64.36 38.85,63.36 43.35,56.46 42.85,55.66 42.15,56.06 41.95,57.26 41.45,56.46
  pour Bottom (isolate 0.1, no thermals): 39.39,63.42 39.38,63.45 39.38,66.48 39.39,66.51 40.01,67.13 40.04,67.14 41.28,67.14 41.28,67.59 37.53,67.59 37.53,62.34 41.28,62.34 41.28,62.79 40.04,62.79 40.01,62.8
  pour Bottom (isolate 0.1, no thermals): 46.98,52.9 47.34,52.69 47.4,52.7 48.11,53.93 48.05,54.12 41.6,57.85 40.8,56.47 44.48,54.34 45.15,54.52 45.19,54.51 45.2,54.51 45.22,54.49 45.22,54.49 46.78,53.59 46.8,53.56 46.82,53.52 46.82,53.52
  pour Route2 (no thermals): -1.54,-11.93 119.25,-11.93 119.25,130.86 -1.54,130.86
BUFF_OUT_NEOPIXEL_IN
  Bottom 0.203: 57,92.21 57.05,92.26 | 57.05,92.26 LED2.4-DIN | IC1.4 57.05,90.21 57.05,92.26
BUZZER_EN
  Bottom 0.203: Q1.1 35.5,74.46 R8.2 35.4,73.06 U$2.2
CAP_SENSE_1  (via drill 0.3)
  Top 0.203: v49.55,62.06 47.85,63.76 47.85,64.76 48,64.91 48.55,64.91
  Bottom 0.203: R12.2 49.55,62.41 v49.55,62.06
  pour Top (no thermals): 48.41,64.91 56.4,56.92 64.4,64.91 56.4,72.91
CC1
  Bottom 0.203: X1.A5 42.05,63.71 R10.2
CC2
  Bottom 0.203: X1.B5 42.05,66.71 R9.2
GND  (via drill 0.3, 0.35)
  Bottom 0.2: U3.2 47.85,50.85 v47.85,50.86
  Bottom 0.203: R8.1 v37.75,73.16 | S1.4 62.48,83.44 v62.45,83.46 62.43,83.44 S1.3 | S2.4 50.38,83.44 v50.35,83.46 50.33,83.44 S2.3 | v61.15,50.16 61.15,50.04 61.3,49.9 61.8,49.4 CONN1.3 CONN1.5 | CONN1.9 65.1,50.97 v64.55,51.86 | C7.2 68.55,79.86 U2.5 | R6.1 v73.65,77.06
  Bottom 0.508: IC1.1 54.27,87.15 v54.35,87.06 | IC1.3 54.27,90.95 v54.25,90.96
  Bottom 0.61: v65.35,52.66 65.35,53.71 C1.2 65.75,53.76 | 65.75,53.76 v66.25,53.76 | v62.65,52.66 62.7,52.71 C2.2 62.8,53.86 U1.4 62.8,56.71 v62.85,56.76 62.85,58.26 | v53.75,54.36 53.8,54.41 U1.13 53.8,58.11 53.75,58.16 | U1.15 51.8,54.41 v51.85,54.36 | U1.25 49.5,65.96 49.35,65.81 C3.2 48.01,65.81 v47.96,65.86 | C4.2 47.9,70.01 v47.85,69.96 | U1.28 53.75,68.96 | U1.59 v64.95,61.96 | U1.39 57.8,73.01 v57.75,72.96 | U1.37 55.8,72.81 55.85,72.76 | C6.1 v58.85,90.96 | v35.55,77.46 35.55,76.61 Q1.2 34.5,76.51 v34.45,76.56 | J1.1 v38.15,56.06 | C21.- 56.38,40.81 55.73,41.46 v55.15,41.46 | C21.- 56.38,41.11 56.73,41.46 v57.55,41.46 | C21.- 56.38,39.74 56.55,39.56 v57.55,39.56 | C21.- 56.38,39.89 56.05,39.56 v55.15,39.56 | C21.- 57.5,40.51 v57.55,40.46 | C21.- 55.2,40.51 v55.15,40.46 | v42.45,69.16 R9.1 X1.B1A12 | 42.45,61.76 R10.1 | 42.45,61.76 v42.45,61.06 | 42.45,61.76 X1.A1B12 | C8.2 v65.55,80.66 | C7.2 v66.85,79.86 | U1.1 65.8,53.81 65.75,53.76 | v46.85,67.96 TP4.TP | TP4.TP 44.45,68.86 v43.86,68.86 | TP4.TP 44.25,66.86 44.06,66.86 v43.86,67.06 | TP4.TP v43.86,67.96
  Bottom 0.7: C11.1 57.15,118.61 v57.15,117.56 | v57.05,126.86 57.05,125.66 LED5.3-GND | C10.1 55.6,114.61 v55.55,114.66 | LED4.3-GND 55.6,105.11 v55.55,105.06 | C9.1 v49.55,108.86 | LED3.3-GND v41.45,113.56 | C5.1 v55.55,100.56 | LED2.3-GND v55.65,91.16 | C44.1 v24.95,82.06 | LED32.3-GND v33.35,77.46 | LED36.3-GND v23.65,102.26 | C48.1 v23.65,92.96 | LED35.3-GND v2.95,96.56 | v11.15,91.76 11.03,91.89 10.18,92.26 C47.1 | C46.1 v13.35,88.96 | v21.35,84.36 20.37,84.89 LED34.3-GND | C45.1 v14.85,80.36 | LED33.3-GND v6.65,75.76 | LED30.3-GND v7.45,55.06 | C42.1 v15.55,50.26 | LED29.3-GND v2.25,34.66 | C41.1 v10.35,39.46 | C40.1 v13.75,39.46 | LED28.3-GND v22.05,44.16 | C38.1 v25.65,46.36 | LED26.3-GND v34.05,51.16 | C32.1 v57.15,29.36 | LED24.3-GND v40.75,17.66 | C36.1 v48.85,22.36 | LED23.3-GND v55.65,3.16 | C35.1 v55.65,12.46 | C34.1 v57.15,15.36 | LED22.3-GND v57.15,24.76 | LED20.3-GND v58.15,37.56 | LED18.3-GND v89.15,27.66 | C30.1 v89.15,36.96 | LED17.3-GND v109.25,33.46 | C29.1 v101.15,38.16 | C28.1 v99.45,40.86 | LED16.3-GND v91.45,45.46 | LED15.3-GND v106.05,53.66 | C27.1 v97.85,49.06 | C26.1 v87.25,47.96 | LED14.3-GND v79.45,52.56 | C14.1 v86.95,83.66 | v78.65,78.76 LED8.3-GND | LED12.3-GND v105.35,74.46 | C24.1 v97.15,79.06 | C22.1 v98.65,90.36 | LED10.3-GND v90.65,85.76 | C23.1 v101.75,90.56 | LED11.3-GND v110.05,95.16 | C15.1 v90.55,92.86 | LED9.3-GND v90.55,102.26 | C12.1 v63.95,107.56 | LED6.3-GND v72.05,112.16 | C39.1 22.1,36.91 v22.05,36.96 | LED27.3-GND 22.1,27.61 v22.05,27.56 | LED21.3-GND v71.25,16.46 | C33.1 v63.15,21.16 | v49.45,50.36 v47.85,50.86 | v46.55,52.06 47.85,50.85
  other vias: 53.65,46.16 52.75,46.66 52.35,47.96 51.55,48.36 50.75,48.76 45.15,52.16 44.35,52.56 43.15,51.96 42.05,52.66 49.55,52.76 48.65,53.26 48.75,52.36 48.65,51.36 47.85,51.86 55.15,72.96 51.05,28.16 85.55,42.06 69.45,53.26 85.05,53.26 85.15,76.66 67.95,76.66 21.85,51.06 46.05,59.56 46.05,57.66 35.25,64.96 35.25,61.96 35.25,67.96 35.25,66.46 35.25,63.56 33.45,73.16 61.75,102.06 74.35,80.36 60.05,54.16 65.35,70.16 65.35,67.16 52.15,56.86 43.55,64.36 35.25,59.26 43.55,63.36 41.95,60.06 41.35,59.06 40.25,59.06 40.05,70.66 41.25,70.66 45.55,79.86 52.15,79.46 50.25,86.26 43.95,82.66 43.35,78.16 49.05,49.66 46.15,51.26 51.95,47.16 51.15,47.66 44.55,51.26 38.75,68.26 42.05,54.26 54.95,46.76 64.95,60.76
  pour Bottom (isolate 0.1, no thermals): 45.94,53.26 44.89,53.87 44.36,53.73 44.32,53.74 44.29,53.76 44.29,53.76 42.78,54.62 42.73,54.61 41.5,52.48 43.19,51.5 44.27,51.79 44.31,51.79 44.33,51.77 44.34,51.77 44.34,51.77 44.72,51.55 45.93,51.87 45.97,51.87 45.98,51.86 46,51.85 46,51.85 50.16,49.45 50.18,49.41 50.2,49.37 50.2,49.37 50.47,48.34 52.1,47.4 52.12,47.37 52.13,47.33 52.13,47.33 52.34,46.57 53.77,45.74 54.8,47.52 54.75,47.72 53.29,48.56 53.27,48.59 53.26,48.63 53.27,48.67 53.3,48.73 53.22,49.06 50.95,50.37 50.56,50.27 50.52,50.27 46.07,52.84 46.05,52.87 46.04,52.91 46.04,52.91
  pour Bottom (isolate 0.1): 52.46,57.47 65.25,57.47 65.25,73.26 52.46,73.26
  pour Route15 (no thermals): -1.54,-11.93 119.25,-11.93 119.25,130.86 -1.54,130.86
  pour Top (rank 2): -1.54,-11.93 119.25,-11.93 119.25,130.86 -1.54,130.86
  pour Bottom (rank 2): -1.54,-11.93 119.25,-11.93 119.25,130.86 -1.54,130.86
N$1
  Bottom 0.2: U2.2 72.35,79.56 R6.2
N$2
  Bottom 0.203: LED2.2-DOUT 55.5,97.61 53.45,99.66 53.45,100.96 41.65,108.16 40.45,109.36 40.45,110.41 LED3.4-DIN
N$3
  Bottom 0.203: LED3.2-DOUT 47.5,110.76 48.75,110.76 50.5,109.48 53.65,104.76 54.15,104.26 56.35,104.26 57.15,105.06 57.15,106.26 LED4.4-DIN
N$4
  Bottom 0.203: LED4.2-DOUT 55,111.61 53.85,112.76 53.85,125.16 54.3,125.61 LED5.4-DIN
N$5
  Bottom 0.203: LED5.2-DOUT 57.9,120.31 59.35,118.86 59.35,111.06 59.85,110.56 62.05,110.56 68.85,114.16 69.45,114.16 70.27,113.34 LED6.4-DIN
N$6
  Bottom 0.203: LED8.4-DIN 76.89,77.99 69.31,82.53 60.85,87.42 60.85,102.68 66.35,106.26 LED6.2-DOUT
N$7
  Bottom 0.203: LED30.2-DOUT 13.5,52.26 14.55,52.26 21.82,50.23 34.45,57.32 34.44,65.46 | LED32.4-DIN 34.15,78.56 34.15,77.56 34.05,77.26 33.45,76.36 34.55,72.16 34.45,68.54 34.44,65.46 | 34.44,65.46
N$8
  Bottom 0.203: LED8.2-DOUT 84.27,84.08 87.25,87.06 87.25,100.26 88.1,101.11 LED9.4-DIN
N$9
  Bottom 0.61: D2.A 42.5,73.07 LS1.- 38.87,74.55 Q1.3
N$10
  Bottom 0.203: R11.1 46.87,47.81 47.41,47.81 U3.1
N$11
  Bottom 0.203: LED10.2-DOUT 96.25,88.96 96.25,91.06 105.95,97.06 107.55,97.06 108.27,96.34 LED11.4-DIN
N$12
  Bottom 0.203: LED11.2-DOUT 104.43,90.84 98.45,84.86 98.45,83.06 105.55,78.56 105.55,76.82 LED12.4-DIN
N$13  (via drill 0.3)
  Top 0.203: v78.65,51.26 75.35,50.16 73.75,51.06 69.55,51.06 68.25,51.71 68.25,53.46 66.35,55.36 66.35,76.46 67.69,77.86 73.55,79.16 85.15,85.86 v87.35,85.26
  Bottom 0.203: LED14.4-DIN v78.65,51.26 | LED12.2-DOUT 98.35,77.26 88.95,82.76 v87.35,85.26
N$15
  Bottom 0.203: LED14.2-DOUT 85.8,50.06 91.65,50.06 101.75,55.66 103.05,55.66 LED15.4-DIN
N$16
  Bottom 0.203: LED15.2-DOUT 100.43,48.94 99.65,48.16 91.05,47.26 89.65,45.86 89.65,44.66 90.68,43.64 LED16.4-DIN
N$17
  Bottom 0.61: D1.C CONN1.1
N$18
  Bottom 0.61: R7.1 D1.A
N$19
  Bottom 0.203: LED16.2-DOUT 101.05,42.29 109.2,37.61 109.55,37.26 109.55,35.82 LED17.4-DIN
N$20
  Bottom 0.203: LED9.2-DOUT 91.95,94.46 91.95,89.66 89.75,87.46 89.75,84.46 90.25,83.96 91.41,83.96 LED10.4-DIN
N$21
  Bottom 0.203: LED24.2-DOUT 46.27,22.78 46.35,22.86 51.75,26.4 51.75,42.61 39.16,49.88 36.91,48.86 36.25,48.86 35.05,50.06 35.05,51.56 34.35,52.26 32.6,52.26 LED26.4-DIN
N$22
  Bottom 0.203: LED23.2-DOUT 55.1,9.61 53.45,11.26 53.45,17.36 51.75,19.06 51.25,19.06 44.85,15.36 43.35,15.36 42.43,16.28 LED24.4-DIN
N$23
  Bottom 0.203: LED22.2-DOUT 58,18.31 59.15,17.16 59.15,4.86 58.55,4.26 57.15,4.26 LED23.4-DIN
N$24
  Bottom 0.203: LED21.2-DOUT 65.01,18.96 64.65,18.96 60.1,21.91 59.95,22.06 59.95,24.46 58.55,25.86 56.45,25.86 55.6,25.01 LED22.4-DIN
N$25
  Bottom 0.203: LED20.2-DOUT 59.65,29.76 59.65,27.56 70.8,20.81 71.55,20.06 71.55,18.82 LED21.4-DIN
N$27  (via drill 0.3)
  Top 0.203: v72.15,50.36 60.45,43.32 60.45,40.76 58.45,38.76 54.95,38.76 54.55,38.36 v54.55,37.56
  Bottom 0.203: LED18.2-DOUT 88.3,34.11 86.95,35.46 86.95,42.15 72.5,50.36 v72.15,50.36 | v54.55,37.56 55.55,37.56 LED20.4-DIN
N$29
  Bottom 0.203: LED26.2-DOUT 28.43,45.64 25.35,42.56 25.35,29.26 24.7,28.61 23.8,28.61 LED27.4-DIN
N$30
  Bottom 0.203: LED27.2-DOUT 21.4,34.11 20.8,34.71 20.05,35.46 20.05,38.86 23.05,41.86 23.05,45.06 22.35,45.76 21.1,45.76 LED28.4-DIN
N$31
  Bottom 0.203: LED28.2-DOUT 16.43,39.56 8.85,34.63 6.25,32.56 5.36,32.56 LED29.4-DIN
N$32
  Bottom 0.203: LED29.2-DOUT 7.77,39.88 14.75,44.16 14.75,45.36 11.25,48.86 9.35,48.86 6.85,51.36 6.85,52.31 LED30.4-DIN
N$35
  Bottom 0.203: LED32.2-DOUT 26.91,79.86 22.85,79.86 12.65,73.96 9.15,73.96 8.43,74.68 LED33.4-DIN
N$36
  Bottom 0.203: LED17.2-DOUT 102.91,35.86 102.05,35.86 94.05,38.86 92.75,37.56 92.75,29.16 92.4,28.81 LED18.4-DIN
N$37
  Bottom 0.203: LED34.2-DOUT 14.81,86.76 13.75,86.76 3.5,91.91 2.55,92.86 2.55,94.01 LED35.4-DIN
N$38
  Bottom 0.203: LED35.2-DOUT 9.1,93.86 12.25,93.86 17.45,91.76 18.85,91.76 19.85,92.76 19.85,100.26 20.7,101.11 LED36.4-DIN
N$40
  Bottom 0.203: LED33.2-DOUT 12.27,80.68 13.05,81.46 21.85,82.56 22.95,83.66 22.95,85.16 21.83,86.29 LED34.4-DIN
NEOPIXEL_BUFF_IN  (via drill 0.3)
  Top 0.203: v59.55,78.36 v59.55,85.83
  Bottom 0.152: 55.25,86.18 53.53,86.18 52.75,86.96 52.75,88.46 53.37,89.08 IC1.2
  Bottom 0.203: U$15.2 59.75,78.36 v59.55,78.36 | v59.55,85.83 59.3,86.08 56.48,86.08 56.38,86.18 55.25,86.18 55.15,86.18
NEOPIXEL_DATA
  Bottom 0.203: LED36.2-DOUT 25.15,94.66 25.15,86.96 38.35,78.96 42.95,77.46 43.35,76.16 43.55,70.06 43.25,69.16 43.25,66.66 TP3.TP
P2_!MODE
  Bottom 0.203: 62.95,81.89 S1.2 | 62.95,81.89 S1.1 59.08,81.89 R4.1 | 62.95,81.89 62.95,75.86 63.33,75.49 64.35,75.49 64.8,75.03 U1.46
P2_!RESET  (via drill 0.3)
  Top 0.152: v53.75,77.06 53.75,79.16 v52.15,80.76
  Top 0.203: v66.55,48.36 65.55,48.36 61.35,52.56 52.85,52.56 44.25,57.76 44.25,60.66 40.75,64.16 40.75,68.08 41.85,69.18 41.85,69.42 45.29,72.86 v52.85,72.86
  Bottom 0.152: U1.34 52.8,76.11 v53.75,77.06 | v52.15,80.76 52.15,81.86 S2.2 | TP1.TP 67.74,48.07 CONN1.10
  Bottom 0.203: S2.1 49.65,81.89 S2.2 53.73,81.89 R5.1 | CONN1.10 v66.55,48.36 | v52.85,72.86 52.8,72.91 U1.34
P2_A0_PDM_MIC_CLK
  Bottom 0.152: 65.6,73.41 65.68,73.49 66.55,73.49 66.75,73.69 66.75,73.86
  Bottom 0.203: U1.50 64.85,70.96 64.45,71.36 64.45,72.26 65.6,73.41 | 66.75,73.86 66.75,75.46 65.8,76.41 U$4.1
P2_A1_PDM_MIC_DATA
  Bottom 0.203: U$3.1 61.85,74.41 U1.43
P2_A2_SPEAKER  (via drill 0.3)
  Top 0.2: v65.35,71.96 60.75,76.36 45.05,76.36 v38.45,72.36
  Bottom 0.2: U1.49 v65.35,71.96 | U$2.1 37.45,71.66 v38.45,72.36
P2_A5
  Bottom 0.203: U1.23 49.95,63.96 49.6,64.31 R12.1
P2_D0_SDA  (via drill 0.3)
  Top 0.2: v39.15,54.46 39.15,56.65 38.25,57.7 38.25,61.26 36.55,62.96 36.55,66.96 38.15,68.65 38.15,70.45 45.43,74.73 46.45,75.36 52.79,75.36 53.6,74.77 54.25,74.76 v54.85,75.46
  Bottom 0.2: J1.3 v39.15,54.46 | U1.36 v54.85,75.46
P2_D1_SCL  (via drill 0.3)
  Top 0.2: v53.85,75.46 53.45,75.86 46.23,75.86 38.95,71.56 37.65,70.82 37.65,68.83 36.15,67.26 36.15,62.86 37.75,61.26 37.75,57.72 36.95,56.26 38.45,53.56 v39.65,53.56
  Bottom 0.2: J1.4 v39.65,53.56 | U1.35 v53.85,75.46
P2_D6_SWCLK  (via drill 0.3)
  Top 0.203: TP7.TP 67.77,50.18 67.77,53.24 64.95,56.06 v64.95,58.06
  Bottom 0.203: U1.55 66.25,65.96 64.05,63.76 64.05,58.76 64.75,58.06 v64.95,58.06 | TP7.TP 63.45,47.16 CONN1.4
  other vias: 67.92,50.03
P2_D7_SWDIO  (via drill 0.3)
  Top 0.203: v63.75,58.06 63.75,51.26 64.15,50.86 65.8,50.86 TP8.TP
  Bottom 0.203: U1.54 66.51,66.82 66.05,66.82 63.55,64.32 63.55,58.26 v63.75,58.06 | TP8.TP 66.45,49.96 62.25,47.36 CONN1.2
  other vias: 66.74,51.8
P2_RGB_B
  Bottom 0.203: U1.31 50.85,72.06 50.45,72.06 49.95,72.56 49.95,75.26 53.65,78.96 54.75,78.96 54.8,79.01 R3.2
P2_RGB_G
  Bottom 0.203: R2.2 56.38,78.99 55.65,78.26 53.55,78.26 50.7,75.41 50.7,73.22 U1.32
P2_RGB_R
  Bottom 0.152: 51.05,75.26 51.05,73.89 51.41,73.53 51.78,73.53 52.05,73.26 52.05,70.26 51.75,69.96 U1.29
  Bottom 0.203: R1.2 57.85,78.96 56.75,77.86 53.65,77.86 51.05,75.26
P2_RX/D9
  Bottom 0.152: 65.65,57.36 65.65,56.74 65.96,56.43 66.38,56.43 66.62,56.2 66.62,55.18 68.45,53.35 68.45,51.06 69.51,50.01 70.25,50.01 TP6.TP
  Bottom 0.203: U1.63 66.25,57.96 65.65,57.36
P2_S0_MOSI
  Bottom 0.203: U$15.1 58.8,75.96 U1.40
P2_S4
  Bottom 0.203: U1.47 65.8,75.03 65.46,75.37 65.19,75.37 R13.1
P2_TX/D8
  Bottom 0.203: U1.64 66.85,56.96 66.95,56.87 66.95,55.32 68.78,53.49 68.78,52.23 TP5.TP
PDM_MIC_CLK
  Bottom 0.2: U2.3 70.7,78.53 71.09,78.14 71.09,77.53 70.9,77.26 70.23,77.26 68.15,78.56 66.35,78.56 65.7,77.91 U$4.2
PDM_MIC_DATA  (via drill 0.3)
  Top 0.2: v63.95,79.16 v61.85,79.16
  Bottom 0.2: U2.4 68.7,79.46 68.41,79.16 v63.95,79.16 | U$3.2 v61.85,79.16
RGB_B
  Bottom 0.203: LED1.BLUE 55.44,83.21 54.85,82.62 R3.1
RGB_G
  Bottom 0.203: R2.1 55.6,81.06 LED1.GREEN
RGB_R
  Bottom 0.203: R1.1 57.85,81.36 LED1.RED
USB_N  (via drill 0.3)
  Top 0.203: v64.95,59.03 64.75,59.23 62.32,59.23 57.9,54.81 55.21,54.81 44.75,65.26 42.75,65.26 v42.75,65.01
  Bottom 0.203: 41.6,65.21 X1.A7 | 41.6,65.21 41.75,65.06 41.75,64.36 41.6,64.21 X1.B7 | U1.62 65.65,58.96 65.32,59.29 64.95,59.29 v64.95,59.03 | v42.75,65.01 42.5,65.26 41.75,65.26 41.7,65.21 41.6,65.21
USB_P  (via drill 0.3)
  Top 0.203: v64.95,59.89 64.75,59.69 62.28,59.69 57.75,55.16 55.35,55.16 44.9,65.62 42.75,65.62 v42.75,65.87
  Bottom 0.203: X1.A6 39.9,64.71 39.75,64.86 39.75,65.56 39.9,65.71 X1.B6 41.66,65.71 41.75,65.62 42.5,65.62 v42.75,65.87 | U1.61 65.65,59.96 65.32,59.64 64.95,59.64 v64.95,59.89
(copper drawn outside any net)
  shapes: Bottom area x1, Route15 area x1, Route2 area x1, Top area x1